# EAGLE schematic backplane (EAGLE 9.2.1)
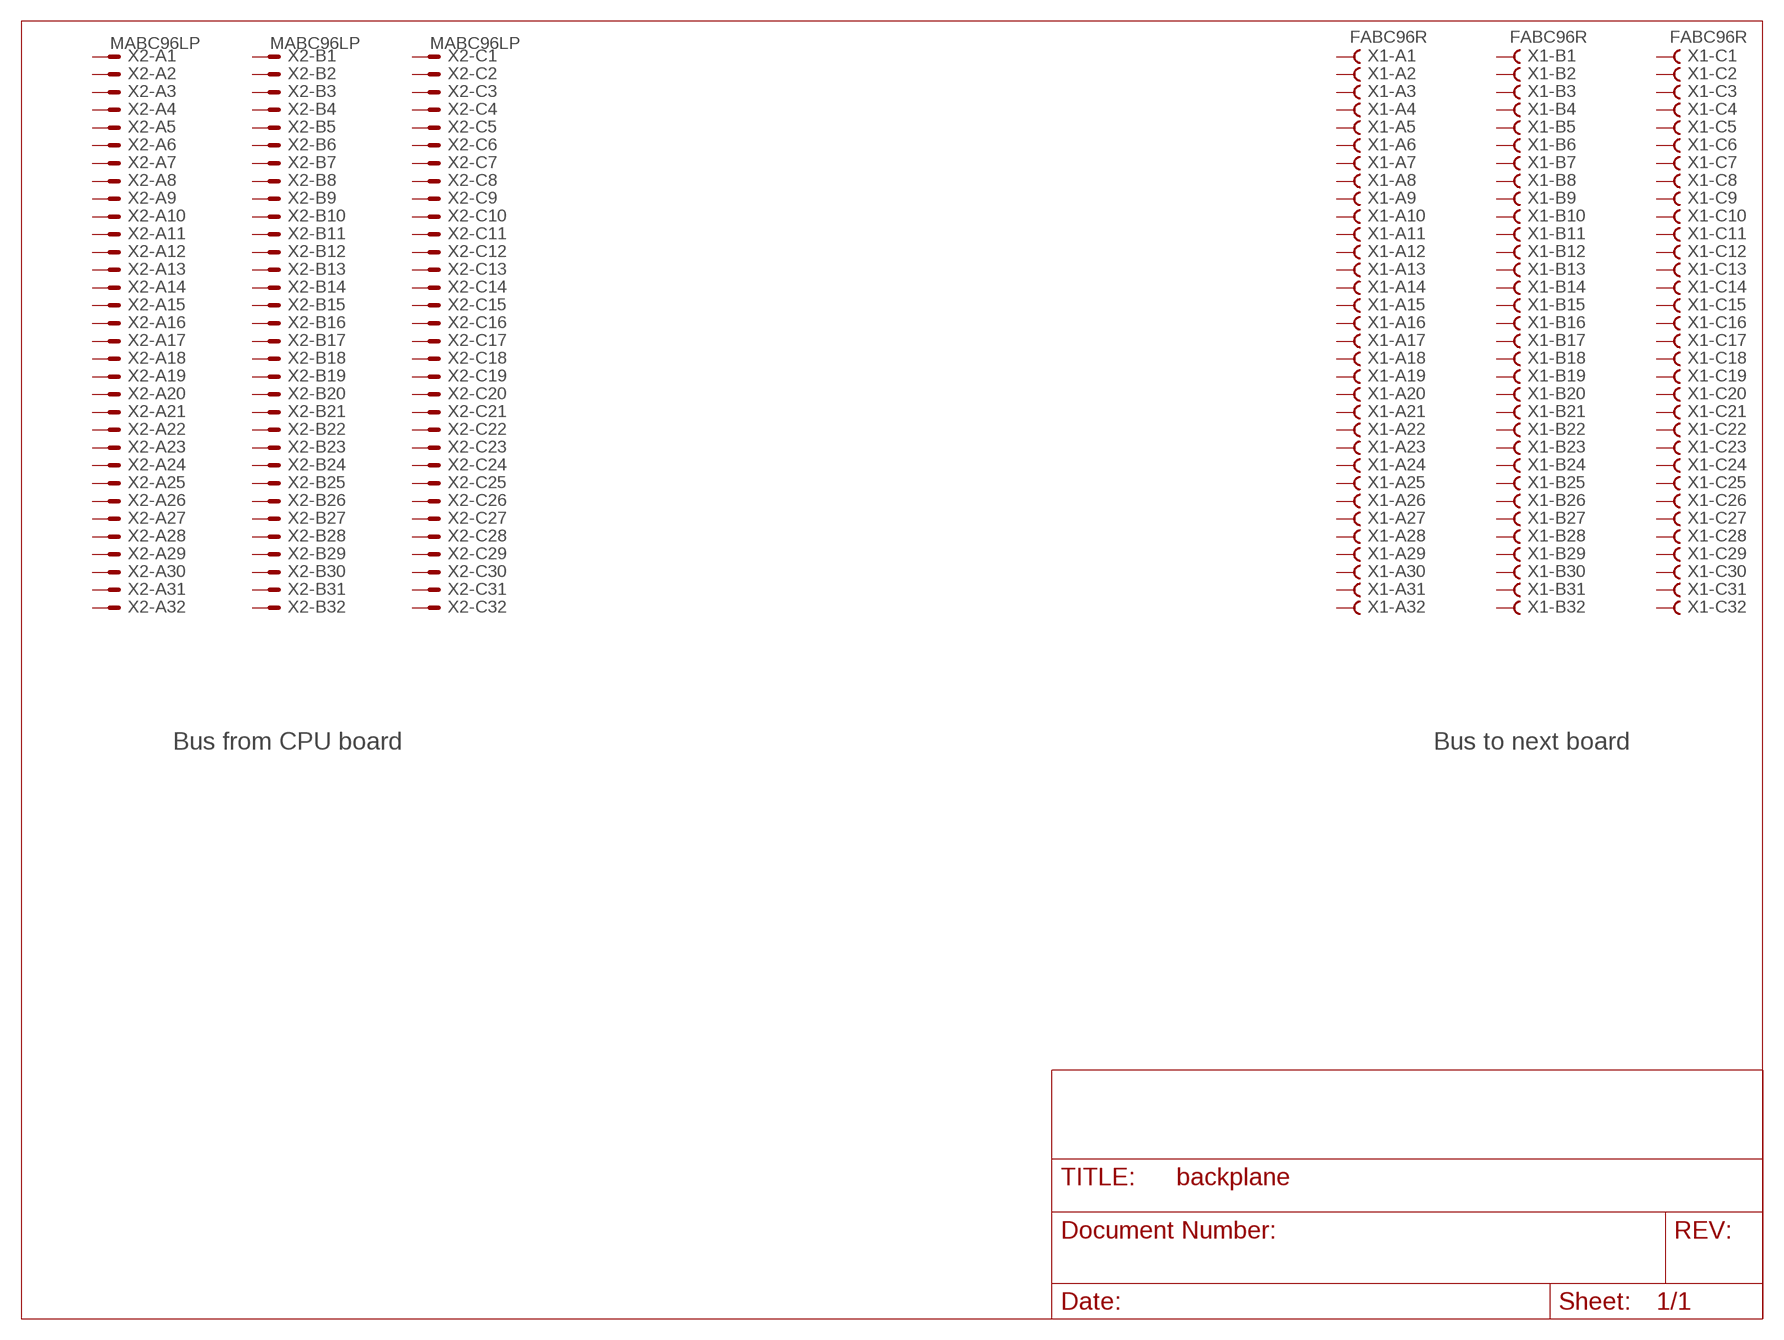
[diagram p0: schematic, sheet 1]

## Parts
X1  FABC96R  [FABC96R]
X2  MABC96LP  [MABC96LP]
Unconnected: X1.A1 X1.A2 X1.A3 X1.A4 X1.A5 X1.A6 X1.A7 X1.A8 X1.A9 X1.A10 X1.A11 X1.A12 X1.A13 X1.A14 X1.A15 X1.A16 X1.A17 X1.A18 X1.A19 X1.A20 X1.A21 X1.A22 X1.A23 X1.A24 X1.A25 X1.A26 X1.A27 X1.A28 X1.A29 X1.A30 X1.A31 X1.A32 X1.B1 X1.B2 X1.B3 X1.B4 X1.B5 X1.B6 X1.B7 X1.B8 X1.B9 X1.B10 X1.B11 X1.B12 X1.B13 X1.B14 X1.B15 X1.B16 X1.B17 X1.B18 X1.B19 X1.B20 X1.B21 X1.B22 X1.B23 X1.B24 X1.B25 X1.B26 X1.B27 X1.B28 X1.B29 X1.B30 X1.B31 X1.B32 X1.C1 X1.C2 X1.C3 X1.C4 X1.C5 X1.C6 X1.C7 X1.C8 X1.C9 X1.C10 X1.C11 X1.C12 X1.C13 X1.C14 X1.C15 X1.C16 X1.C17 X1.C18 X1.C19 X1.C20 X1.C21 X1.C22 X1.C23 X1.C24 X1.C25 X1.C26 X1.C27 X1.C28 X1.C29 X1.C30 X1.C31 X1.C32 X2.A1 X2.A2 X2.A3 X2.A4 X2.A5 X2.A6 X2.A7 X2.A8 X2.A9 X2.A10 X2.A11 X2.A12 X2.A13 X2.A14 X2.A15 X2.A16 X2.A17 X2.A18 X2.A19 X2.A20 X2.A21 X2.A22 X2.A23 X2.A24 X2.A25 X2.A26 X2.A27 X2.A28 X2.A29 X2.A30 X2.A31 X2.A32 X2.B1 X2.B2 X2.B3 X2.B4 X2.B5 X2.B6 X2.B7 X2.B8 X2.B9 X2.B10 X2.B11 X2.B12 X2.B13 X2.B14 X2.B15 X2.B16 X2.B17 X2.B18 X2.B19 X2.B20 X2.B21 X2.B22 X2.B23 X2.B24 X2.B25 X2.B26 X2.B27 X2.B28 X2.B29 X2.B30 X2.B31 X2.B32 X2.C1 X2.C2 X2.C3 X2.C4 X2.C5 X2.C6 X2.C7 X2.C8 X2.C9 X2.C10 X2.C11 X2.C12 X2.C13 X2.C14 X2.C15 X2.C16 X2.C17 X2.C18 X2.C19 X2.C20 X2.C21 X2.C22 X2.C23 X2.C24 X2.C25 X2.C26 X2.C27 X2.C28 X2.C29 X2.C30 X2.C31 X2.C32

## Notes on the sheet
- Bus from CPU board | Bus to next board

## Library data of the parts
X1 = con-vg:FABC96R: CONNECTOR female, 96 pins, type R, rows ABC, grid 2.54 mm
X2 = con-vg:MABC96LP: CONNECTOR male, 96 pins, type C, rows ABC, grid 2.54 mm with mounting clip